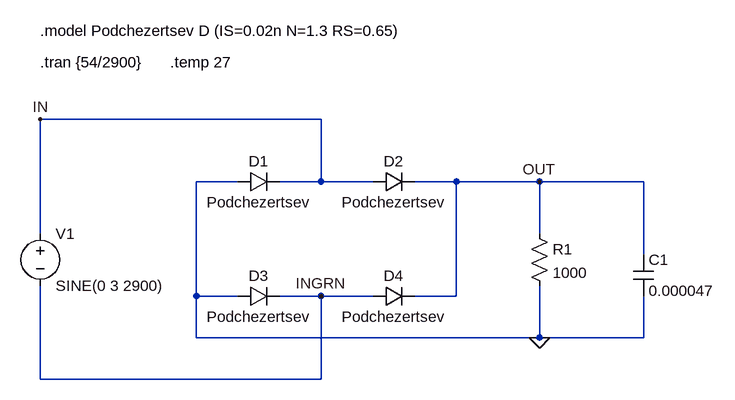
[diagram p0: schematic Draft3.B.47.asc]
Draft3.B.47.asc, the LTspice schematic file:
Version 4
SHEET 1 161040 680
WIRE 320 128 -112 128
WIRE 192 224 128 224
WIRE 320 224 320 128
WIRE 320 224 256 224
WIRE 400 224 320 224
WIRE 528 224 464 224
WIRE 656 224 528 224
WIRE 816 224 656 224
WIRE -112 304 -112 128
WIRE 656 304 656 224
WIRE 816 336 816 224
WIRE 128 400 128 224
WIRE 192 400 128 400
WIRE 320 400 256 400
WIRE 400 400 320 400
WIRE 528 400 528 224
WIRE 528 400 464 400
WIRE 128 464 128 400
WIRE 656 464 656 384
WIRE 656 464 128 464
WIRE 816 464 816 400
WIRE 816 464 656 464
WIRE -112 528 -112 384
WIRE 320 528 320 400
WIRE 320 528 -112 528
FLAG 656 464 0
FLAG -112 128 IN
FLAG 656 224 OUT
FLAG 320 400 INGRN
SYMBOL diode 192 240 R270
WINDOW 0 32 32 VTop 2
WINDOW 3 0 32 VBottom 2
SYMATTR InstName D1
SYMATTR Value Podchezertsev
SYMBOL diode 400 240 R270
WINDOW 0 32 32 VTop 2
WINDOW 3 0 32 VBottom 2
SYMATTR InstName D2
SYMATTR Value Podchezertsev
SYMBOL diode 192 416 R270
WINDOW 0 32 32 VTop 2
WINDOW 3 0 32 VBottom 2
SYMATTR InstName D3
SYMATTR Value Podchezertsev
SYMBOL diode 400 416 R270
WINDOW 0 32 32 VTop 2
WINDOW 3 0 32 VBottom 2
SYMATTR InstName D4
SYMATTR Value Podchezertsev
SYMBOL voltage -112 288 R0
WINDOW 123 0 0 Left 0
WINDOW 39 0 0 Left 0
SYMATTR InstName V1
SYMATTR Value SINE(0 3 2900)
SYMBOL res 640 288 R0
SYMATTR InstName R1
SYMATTR Value 1000
SYMBOL cap 800 336 R0
SYMATTR InstName C1
SYMATTR Value 0.000047
TEXT -112 -8 Left 2 !.model Podchezertsev D (IS=0.02n N=1.3 RS=0.65)
TEXT -112 40 Left 2 !.tran {54/2900}
TEXT 88 40 Left 2 !.temp 27

The netlist it stands for:
* Draft3.B.47.asc
D1 0 IN Podchezertsev
D2 IN OUT Podchezertsev
D3 0 INGRN Podchezertsev
D4 INGRN OUT Podchezertsev
V1 IN INGRN SINE(0 3 2900)
R1 OUT 0 1000
C1 OUT 0 0.000047
.model D D
.lib standard.dio
.model Podchezertsev D (IS=0.02n N=1.3 RS=0.65)
.tran {54/2900}
.temp 27
.backanno
.end